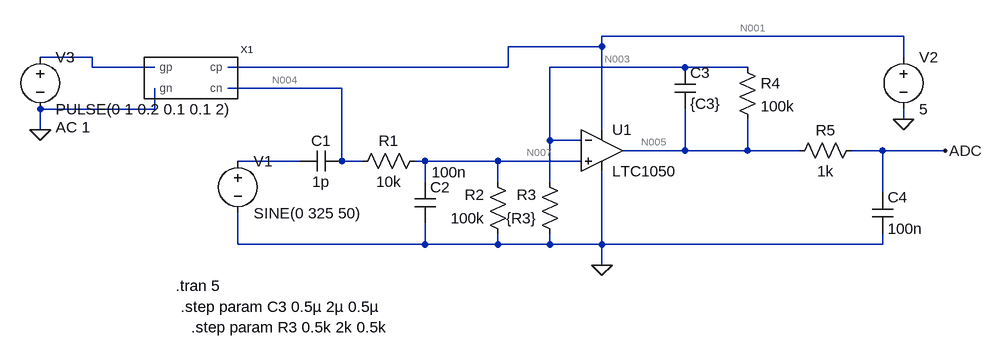
[diagram p0: schematic Draft2.asc]
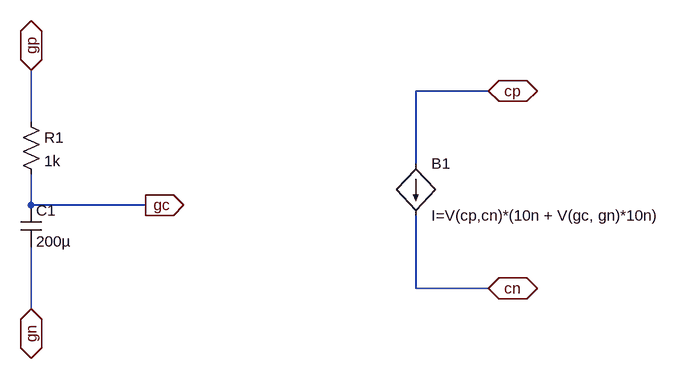
[diagram p1: sub-circuit capteur_graphite.asc]
Draft2.asc, the LTspice schematic file:
Version 4
SHEET 1 1028 680
WIRE 816 0 352 0
WIRE 352 16 352 0
WIRE 352 16 208 16
WIRE -432 32 -512 32
WIRE 816 32 816 0
WIRE -432 48 -432 32
WIRE -336 48 -432 48
WIRE 208 48 208 16
WIRE 208 48 -224 48
WIRE 480 48 272 48
WIRE 576 48 480 48
WIRE -48 80 -224 80
WIRE -336 112 -336 80
WIRE -336 112 -512 112
WIRE 816 128 816 112
WIRE -512 144 -512 112
WIRE 352 144 352 16
WIRE 272 160 272 48
WIRE 320 160 272 160
WIRE 480 176 480 112
WIRE 480 176 384 176
WIRE 576 176 576 128
WIRE 576 176 480 176
WIRE 656 176 576 176
WIRE 784 176 736 176
WIRE 880 176 784 176
WIRE -112 192 -208 192
WIRE -48 192 -48 80
WIRE -16 192 -48 192
WIRE 80 192 64 192
WIRE 192 192 80 192
WIRE 320 192 192 192
WIRE 80 224 80 192
WIRE 192 224 192 192
WIRE 272 224 272 160
WIRE 784 240 784 176
WIRE -208 320 -208 272
WIRE 80 320 80 288
WIRE 80 320 -208 320
WIRE 192 320 192 304
WIRE 192 320 80 320
WIRE 272 320 272 304
WIRE 272 320 192 320
WIRE 352 320 352 208
WIRE 352 320 272 320
WIRE 784 320 784 304
WIRE 784 320 352 320
WIRE 352 352 352 320
FLAG 816 128 0
FLAG 352 352 0
FLAG -512 144 0
FLAG 880 176 ADC
SYMBOL capteur_graphite -288 64 R0
SYMATTR InstName X1
SYMBOL cap -48 176 R90
WINDOW 0 0 32 VBottom 2
WINDOW 3 32 32 VTop 2
SYMATTR InstName C1
SYMATTR Value 1p
SYMBOL voltage -208 176 R0
WINDOW 123 0 0 Left 0
WINDOW 39 0 0 Left 0
SYMATTR InstName V1
SYMATTR Value SINE(0 325 50)
SYMBOL res 80 176 R90
WINDOW 0 0 56 VBottom 2
WINDOW 3 32 56 VTop 2
SYMATTR InstName R1
SYMATTR Value 10k
SYMBOL res 208 320 R180
WINDOW 0 36 76 Left 2
WINDOW 3 36 40 Left 2
SYMATTR InstName R2
SYMATTR Value 100k
SYMBOL res 288 320 R180
WINDOW 0 36 76 Left 2
WINDOW 3 36 40 Left 2
SYMATTR InstName R3
SYMATTR Value {R3}
SYMBOL cap 64 224 R0
WINDOW 3 26 -15 Left 2
SYMATTR Value 100n
SYMATTR InstName C2
SYMBOL OpAmps\\LTC1050 352 112 R0
SYMATTR InstName U1
SYMBOL cap 464 48 R0
SYMATTR InstName C3
SYMATTR Value {C3}
SYMBOL res 560 32 R0
SYMATTR InstName R4
SYMATTR Value 100k
SYMBOL res 752 160 R90
WINDOW 0 0 56 VBottom 2
WINDOW 3 32 56 VTop 2
SYMATTR InstName R5
SYMATTR Value 1k
SYMBOL cap 768 240 R0
SYMATTR InstName C4
SYMATTR Value 100n
SYMBOL voltage 816 16 R0
WINDOW 123 0 0 Left 0
WINDOW 39 0 0 Left 0
SYMATTR InstName V2
SYMATTR Value 5
SYMBOL voltage -512 16 R0
WINDOW 123 24 124 Left 2
WINDOW 39 0 0 Left 0
SYMATTR Value2 AC 1
SYMATTR InstName V3
SYMATTR Value PULSE(0 1 0.2 0.1 0.1 2)
TEXT -304 384 Left 2 !.tran 5
TEXT -296 416 Left 2 !.step param C3 0.5µ 2µ 0.5µ
TEXT -280 448 Left 2 !.step param R3 0.5k 2k 0.5k

capteur_graphite.asc, the sub-circuit schematic file:
Version 4
SHEET 1 1052 680
WIRE 736 32 624 32
WIRE 32 80 32 0
WIRE 624 144 624 32
WIRE 32 208 32 160
WIRE 208 208 32 208
WIRE 624 336 624 224
WIRE 736 336 624 336
WIRE 32 368 32 272
FLAG 32 0 gp
IOPIN 32 0 BiDir
FLAG 32 368 gn
IOPIN 32 368 BiDir
FLAG 208 208 gc
IOPIN 208 208 Out
FLAG 736 32 cp
IOPIN 736 32 BiDir
FLAG 736 336 cn
IOPIN 736 336 BiDir
SYMBOL res 16 64 R0
SYMATTR InstName R1
SYMATTR Value 1k
SYMBOL cap 16 208 R0
SYMATTR InstName C1
SYMATTR Value 200µ
SYMBOL bi 624 144 R0
SYMATTR InstName B1
SYMATTR Value I=V(cp,cn)*(10n + V(gc, gn)*10n)

The netlist it stands for:
* Draft2.asc
XX1 N001 N004 N002 0 capteur_graphite
C1 N004 N006 1p
V1 N006 0 SINE(0 325 50)
R1 N007 N004 10k
R2 0 N007 100k
R3 0 N003 {R3}
C2 N007 0 100n
XU1 N007 N003 N001 0 N005 LTC1050  ; pins In+ In- V+ V- OUT
C3 N003 N005 {C3}
R4 N003 N005 100k
R5 ADC N005 1k
C4 ADC 0 100n
V2 N001 0 5
V3 N002 0 PULSE(0 1 0.2 0.1 0.1 2) AC 1

* block symbol definitions
.subckt capteur_graphite cp cn gp gn
R1 gp gc 1k
C1 gc gn 200µ
B1 cp cn I=V(cp,cn)*(10n + V(gc, gn)*10n)
.ends capteur_graphite

.tran 5
.step param C3 0.5µ 2µ 0.5µ
.step param R3 0.5k 2k 0.5k
.lib LTC.lib
.backanno
.end

* Results of the author's LTspice run, read from the files saved beside the schematic
* Operating Point (first step), zero values left out:
*   c3 = 500 n
*   V(n001) = 5 V
*   V(n004) = 5.494 mV
*   V(n007) = 4.995 mV
*   V(n003) = 4.995 mV
*   V(n005) = 1.004 V
*   V(adc) = 1.004 V
*   I(R1) = -49.95 nA
*   I(R2) = -49.95 nA
*   I(R3) = -9.989 µA
*   I(R4) = -9.989 µA
*   I(V2) = -756.7 µA
*   Ix(x1:CP) = 49.95 nA
*   Ix(x1:CN) = -49.95 nA
*   Ix(u1:3) = 756.6 µA
*   Ix(u1:4) = -746.6 µA
*   Ix(u1:5) = -9.989 µA